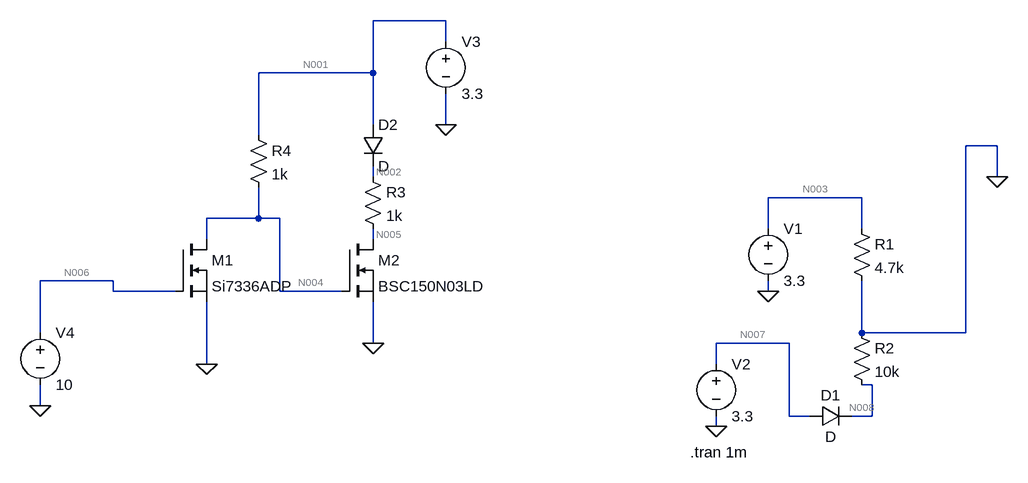
[diagram p0: schematic Draft1.asc]
Draft1.asc, the LTspice schematic file:
Version 4.1
SHEET 1 880 680
WIRE -240 -240 -352 -240
WIRE -240 -208 -240 -240
WIRE -352 -160 -352 -240
WIRE -352 -160 -528 -160
WIRE -352 -80 -352 -160
WIRE -240 -80 -240 -128
WIRE -528 -64 -528 -160
WIRE 608 -48 560 -48
WIRE -352 0 -352 -16
WIRE 608 0 608 -48
WIRE 400 32 256 32
WIRE -528 64 -528 16
WIRE -528 64 -608 64
WIRE -496 64 -528 64
WIRE 256 80 256 32
WIRE 400 80 400 32
WIRE -608 96 -608 64
WIRE -352 96 -352 80
WIRE -752 160 -864 160
WIRE -752 176 -752 160
WIRE -656 176 -752 176
WIRE -496 176 -496 64
WIRE -400 176 -496 176
WIRE 256 176 256 160
WIRE -864 240 -864 160
WIRE 400 240 400 160
WIRE 560 240 560 -48
WIRE 560 240 400 240
WIRE -352 256 -352 192
WIRE 288 256 176 256
WIRE -608 288 -608 192
WIRE 176 288 176 256
WIRE 416 320 400 320
WIRE -864 352 -864 320
WIRE 288 368 288 256
WIRE 320 368 288 368
WIRE 416 368 416 320
WIRE 416 368 384 368
WIRE 176 384 176 368
FLAG 256 176 0
FLAG 176 384 0
FLAG 608 0 0
FLAG -352 256 0
FLAG -608 288 0
FLAG -864 352 0
FLAG -240 -80 0
SYMBOL res 384 64 R0
SYMATTR InstName R1
SYMATTR Value 4.7k
SYMBOL res 384 224 R0
SYMATTR InstName R2
SYMATTR Value 10k
SYMBOL voltage 256 64 R0
WINDOW 123 0 0 Left 0
WINDOW 39 0 0 Left 0
SYMATTR InstName V1
SYMATTR Value 3.3
SYMBOL voltage 176 272 R0
WINDOW 123 0 0 Left 0
WINDOW 39 0 0 Left 0
SYMATTR InstName V2
SYMATTR Value 3.3
SYMBOL diode 320 384 R270
WINDOW 0 32 32 VTop 2
WINDOW 3 0 32 VBottom 2
SYMATTR InstName D1
SYMBOL nmos -656 96 R0
SYMATTR InstName M1
SYMATTR Value Si7336ADP
SYMBOL nmos -400 96 R0
SYMATTR InstName M2
SYMATTR Value BSC150N03LD
SYMBOL diode -368 -80 R0
SYMATTR InstName D2
SYMBOL res -368 -16 R0
SYMATTR InstName R3
SYMATTR Value 1k
SYMBOL voltage -240 -224 R0
WINDOW 123 0 0 Left 0
WINDOW 39 0 0 Left 0
SYMATTR InstName V3
SYMATTR Value 3.3
SYMBOL voltage -864 224 R0
WINDOW 123 0 0 Left 0
WINDOW 39 0 0 Left 0
SYMATTR InstName V4
SYMATTR Value 10
SYMBOL res -544 -80 R0
SYMATTR InstName R4
SYMATTR Value 1k
TEXT 136 424 Left 2 !.tran 1m

The netlist it stands for:
* Draft1.asc
R1 N003 0 4.7k
R2 0 N008 10k
V1 N003 0 3.3
V2 N007 0 3.3
D1 N007 N008 D
M1 N004 N006 0 0 Si7336ADP
M2 N005 N004 0 0 BSC150N03LD
D2 N001 N002 D
R3 N002 N005 1k
V3 N001 0 3.3
V4 N006 0 10
R4 N001 N004 1k
.model D D
.lib standard.dio
.model NMOS NMOS
.model PMOS PMOS
.lib standard.mos
.tran 1m
.backanno
.end

* Results of the author's LTspice run, read from the files saved beside the schematic
* Operating Point, zero values left out:
*   V(n008) = 2.679 V
*   V(n004) = 7.474 µV
*   V(n006) = 10 V
*   V(n001) = 3.3 V
*   V(n003) = 3.3 V
*   V(n007) = 3.3 V
*   V(n005) = 3.115 V
*   V(n002) = 3.115 V
*   I(V1) = -702.1 µA
*   Id(M1) = 3.3 mA
*   Is(M1) = -3.3 mA
*   I(R1) = 702.1 µA
*   I(D1) = 267.9 µA
*   I(D2) = 12.75 pA
*   I(R2) = -267.9 µA
*   I(R3) = 12.75 pA
*   I(R4) = 3.3 mA
*   I(V2) = -267.9 µA
*   Id(M2) = 9.758 pA
*   Is(M2) = -9.758 pA
*   I(V3) = -3.3 mA